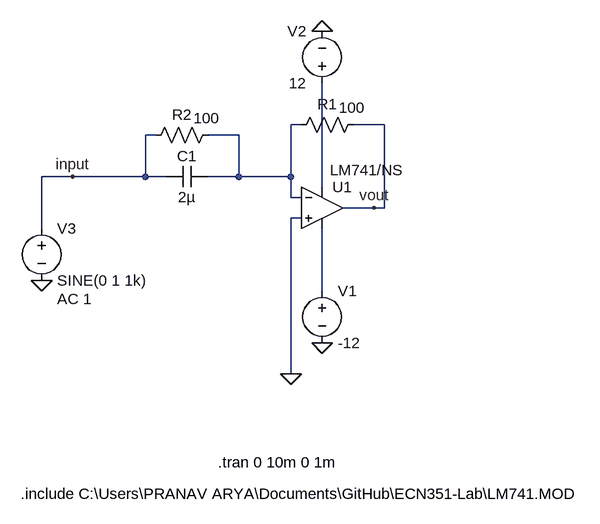
[diagram p0: schematic diffrentior.asc]
diffrentior.asc, the LTspice schematic file:
Version 4
SHEET 1 880 680
WIRE 224 0 208 0
WIRE 352 0 304 0
WIRE 0 16 -16 16
WIRE 128 16 80 16
WIRE -128 80 -176 80
WIRE -16 80 -16 16
WIRE -16 80 -128 80
WIRE 16 80 -16 80
WIRE 128 80 128 16
WIRE 128 80 80 80
WIRE 208 80 208 0
WIRE 208 80 128 80
WIRE 256 96 256 -64
WIRE 208 112 208 80
WIRE 224 112 208 112
WIRE 336 128 288 128
WIRE 352 128 352 0
WIRE 352 128 336 128
WIRE 224 144 208 144
WIRE -176 160 -176 80
WIRE 256 256 256 160
WIRE 208 384 208 144
FLAG 256 336 0
FLAG 256 -144 0
FLAG -176 240 0
FLAG 208 384 0
FLAG 336 128 vout
FLAG -128 80 input
SYMBOL OpAmps\\opamp2 256 64 R0
WINDOW 3 12 6 Left 2
SYMATTR Value LM741/NS
SYMATTR InstName U1
SYMBOL voltage 256 240 R0
WINDOW 123 0 0 Left 0
WINDOW 39 0 0 Left 0
SYMATTR InstName V1
SYMATTR Value -12
SYMBOL voltage 256 -48 R180
WINDOW 0 24 96 Left 2
WINDOW 3 24 16 Left 2
WINDOW 123 0 0 Left 0
WINDOW 39 0 0 Left 0
SYMATTR InstName V2
SYMATTR Value 12
SYMBOL res 320 -16 R90
WINDOW 0 0 56 VBottom 2
WINDOW 3 -26 18 VTop 2
SYMATTR InstName R1
SYMATTR Value 100
SYMBOL voltage -176 144 R0
WINDOW 123 24 124 Left 2
WINDOW 39 0 0 Left 0
SYMATTR Value2 AC 1
SYMATTR InstName V3
SYMATTR Value SINE(0 1 1k)
SYMBOL cap 80 64 R90
WINDOW 0 0 32 VBottom 2
WINDOW 3 32 32 VTop 2
SYMATTR InstName C1
SYMATTR Value 2µ
SYMBOL res 96 0 R90
WINDOW 0 0 56 VBottom 2
WINDOW 3 -26 18 VTop 2
SYMATTR InstName R2
SYMATTR Value 100
TEXT -208 568 Left 2 !.include C:\\Users\\PRANAV ARYA\\Documents\\GitHub\\ECN351-Lab\\LM741.MOD
TEXT 96 520 Left 2 !.tran 0 10m 0 1m

The netlist it stands for:
* diffrentior.asc
XU1 0 N001 N002 N003 vout LM741/NS  ; pins In+ In- V+ V- OUT
V1 N003 0 -12
V2 N002 0 12
R1 vout N001 100
V3 input 0 SINE(0 1 1k) AC 1
C1 N001 input 2µ
R2 N001 input 100
.include C:\Users\PRANAV ARYA\Documents\GitHub\ECN351-Lab\LM741.MOD
.tran 0 10m 0 1m
.backanno
.end